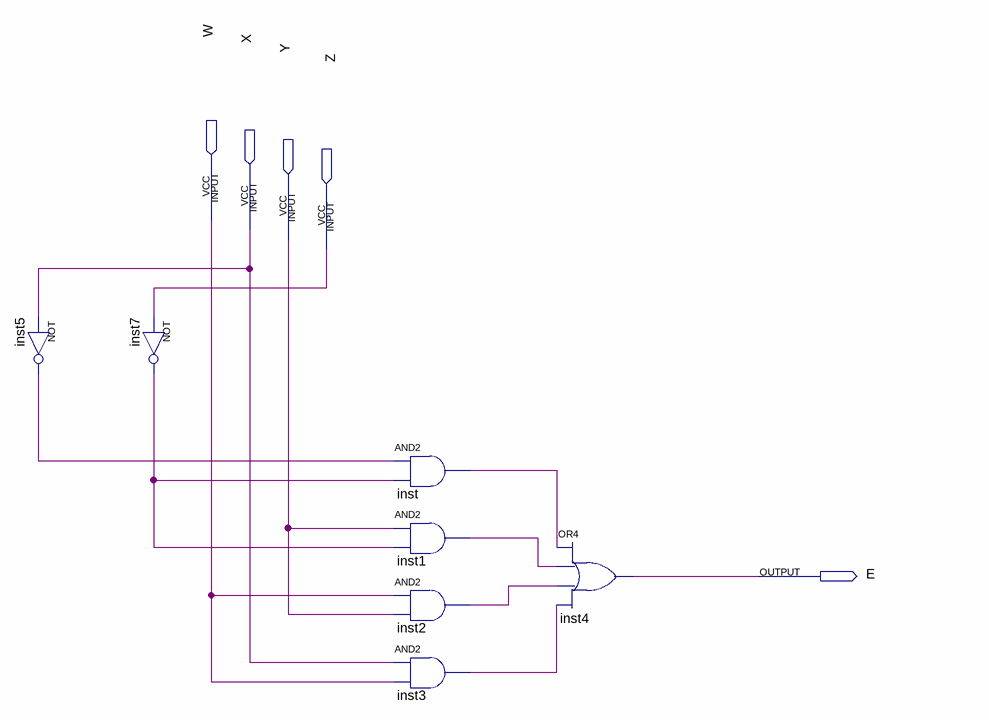
[diagram p0: schematic sheet]
// Quartus schematic SEG_E.bdf as structural Verilog: 7 symbols, 5 pins
module SEG_E (
  input  W,
  input  X,
  input  Y,
  input  Z,
  output E
);

  wire inst1_out, inst2_out, inst3_out, inst5_out, inst7_out, inst_out;

  not inst5 (inst5_out, X);
  not inst7 (inst7_out, Z);
  and inst (inst_out, inst5_out, inst7_out);
  and inst1 (inst1_out, Y, inst7_out);
  and inst2 (inst2_out, W, Y);
  and inst3 (inst3_out, X, W);
  or inst4 (E, inst_out, inst1_out, inst2_out, inst3_out);
endmodule
